# Altium project Control_Board_Model_C.PrjPcb (part 1 of 3)
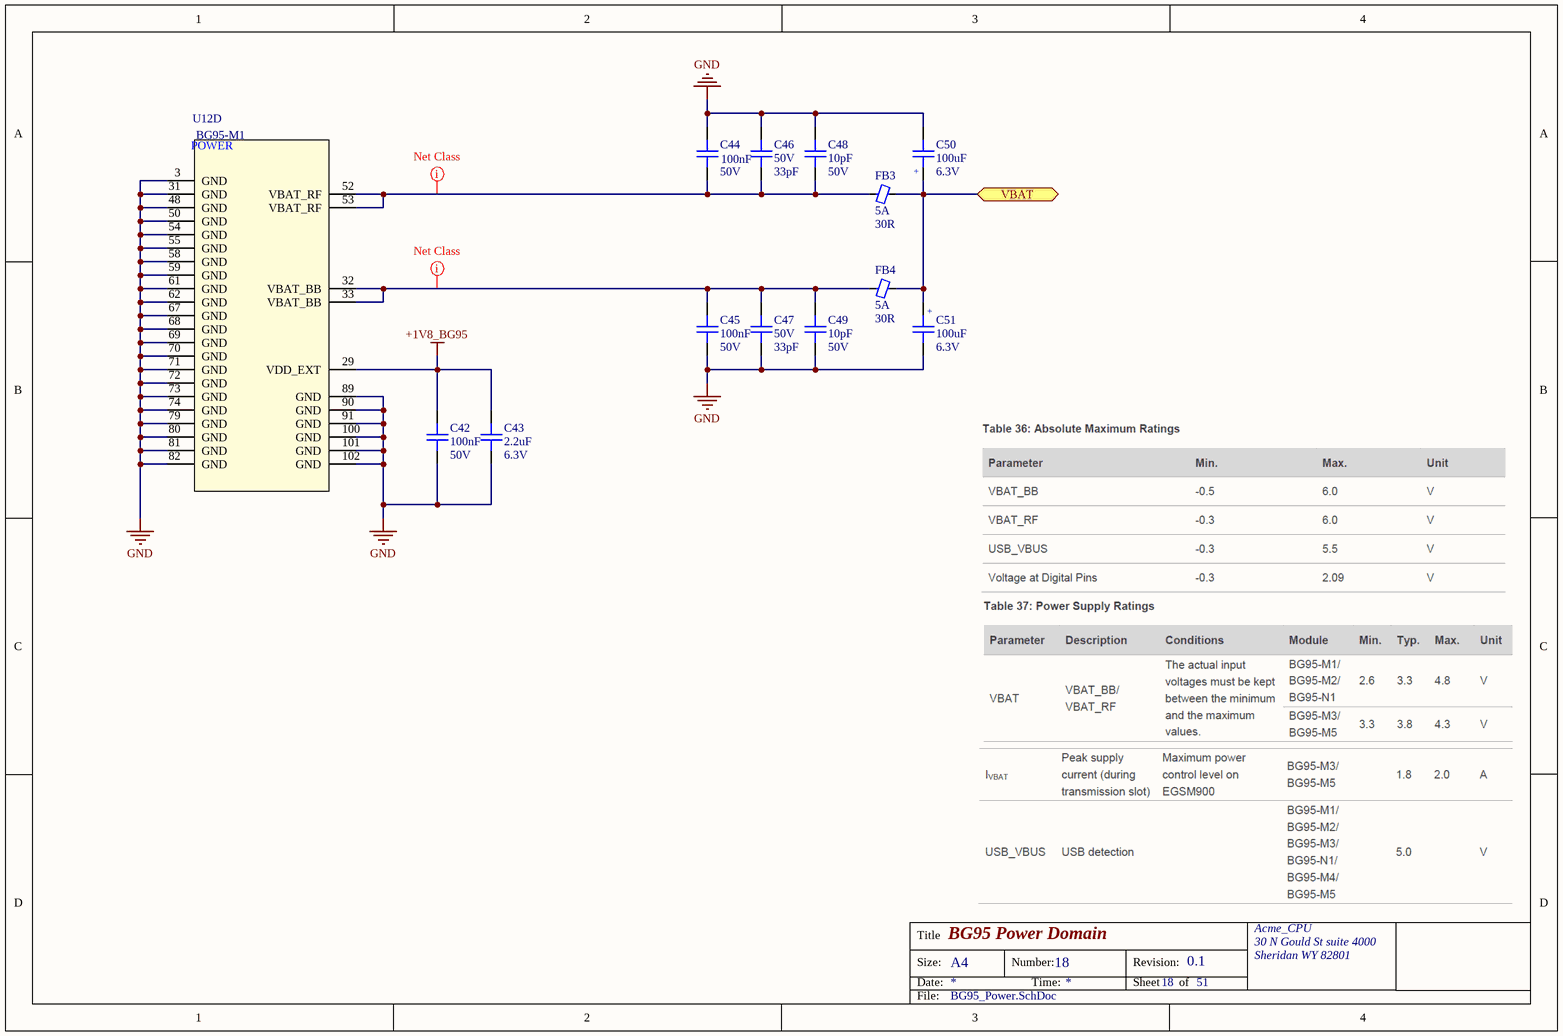
[diagram p0: BG95_Power.SchDoc]
_Title: Control_Board; _Revision: 0.1; _PCBNumber: 001; _PCBModel: C202; _HWEngineer: VSI; _DocumentDate: 20210305; _DateCode: 2021.12; _CompanyName: Acme_CPU; _BoardName: Control_Board; _ApprovedBy: PGU; _address2: Sheridan WY 82801; _address1: 30 N Gould St suite 4000
12 sheets, 113 parts. Net scope: hierarchical (ports join the sheet entries above them; power ports are global).
Board files: Control_Board_Model_C_Rigid_Flex.PcbDoc, Control_Board_Model_C_Rigid_Flex_Flipped.PcbDoc
Sheets:
  BG95_Power.SchDoc
  BG95_Misc.SchDoc
  Top_Level_Block_Diagram.SchDoc
    P104 = MCU_Module.SchDoc
      P02 = UART_TagConnect.SchDoc
    P16_P25 = Motor Connection.SchDoc
    SENS = Sensor Connection.SchDoc
      TLT_SENS = BMI270_IMU.SchDoc
    UI = User_Interface.SchDoc
    AUX = Auxiliary.SchDoc
    P107 = ESP32_Module.SchDoc
  IM69D130_MEMS_Microphone.SchDoc

## Sheet BG95_Power.SchDoc: BG95 Power Domain
size A4; DocumentNumber: 18; SheetNumber: 18; SheetTotal: 51

### Parts
C42  Capacitance: 100nF  Voltage: 50V  [C0402]  (hidden comment: CAP CER 0.1UF 50V X7R 0402)
C43  Capacitance: 2.2uF  Voltage: 6.3V  [C0402]  (hidden comment: CAP CER 2.2UF 6.3V X5R 0402)
C44  Capacitance: 100nF  Voltage: 50V  [C0402]  (hidden comment: CAP CER 0.1UF 50V X7R 0402)
C45  Capacitance: 100nF  Voltage: 50V  [C0402]  (hidden comment: CAP CER 0.1UF 50V X7R 0402)
C46  Voltage Rating: 50V  Capacitance: 33pF  [C0402]  (hidden comment: CAP CER 33PF 50V C0G/NPO 0402)
C47  Voltage Rating: 50V  Capacitance: 33pF  [C0402]  (hidden comment: CAP CER 33PF 50V C0G/NPO 0402)
C48  Capacitance: 10pF  Voltage Rating: 50V  [C0402]  (hidden comment: CAP CER 10PF 50V C0G/NP0 0402)
C49  Capacitance: 10pF  Voltage Rating: 50V  [C0402]  (hidden comment: CAP CER 10PF 50V C0G/NP0 0402)
C50  Capacitance: 100uF  Voltage Rating: 6.3V  [WCAP-ASLI_5x5.5]  (hidden comment: CAP ALUM 100 UF 20% 6.3 V SMD)
C51  Capacitance: 100uF  Voltage Rating: 6.3V  [WCAP-ASLI_5x5.5]  (hidden comment: CAP ALUM 100 UF 20% 6.3 V SMD)
FB3  Current Rating: 5A  Impedance: 30R  [L0603]  (hidden comment: MPZ1608S300ATAH0)
FB4  Current Rating: 5A  Impedance: 30R  [L0603]  (hidden comment: MPZ1608S300ATAH0)
U12  BG95-M1  [BG95]  (part D of 6)

### Ports
VBAT

### Nets
+1V8_BG95: C42.2 C43.2 U12.29(VDD_EXT)
GND: C42.1 C43.1 C44.2 C45.1 C46.2 C47.1 C48.2 C49.1 C50.2 C51.2 U12.3(GND) U12.31(GND) U12.48(GND) U12.50(GND) U12.54(GND) U12.55(GND) U12.58(GND) U12.59(GND) U12.61(GND) U12.62(GND) U12.67(GND) U12.68(GND) U12.69(GND) U12.70(GND) U12.71(GND) U12.72(GND) U12.73(GND) U12.74(GND) U12.79(GND) U12.80(GND) U12.81(GND) U12.82(GND) U12.89(GND) U12.90(GND) U12.91(GND) U12.100(GND) U12.101(GND) U12.102(GND)
NetC44_1: C44.1 C46.1 C48.1 FB3.1 U12.52(VBAT_RF) U12.53(VBAT_RF)
NetC45_2: C45.2 C47.2 C49.2 FB4.1 U12.32(VBAT_BB) U12.33(VBAT_BB)
NetC50_1: C50.1 C51.1 FB3.2 FB4.2 ; port VBAT

### Layout directives
net class BG95_PWR: NetC44_1, NetC45_2

### Notes on the sheet
- Title
- Size:
- Date:
- A4
- Number:
- Time:
- Revision:
- Sheet
- of
- File:
- (in symbol CAP ALUM 100 UF 20% 6.3 V SMD) +
- (in symbol MOD BG95 RX TXRX CELLULAR LTE/NAV SMD, part D) POWER

### Library data of the parts
C42 C44 C45 = CAP CER 0.1UF 50V X7R 0402: 0.1µF ±10% 50V Ceramic Capacitor X7R 0402 (1005 Metric); Manufacturer: TDK; Manufacturer Part Number: CGA2B3X7R1H104K050BB; Supplier 1: Digi-Key; Stock 1: 2925303; Pricing 1: 1=0.17, 10=0.118, 50=0.0668, 100=0.0553, 500=0.0388, 1000=0.0321, 2500=0.0299, 5000=0.0273 (USD); Mount: Surface Mount; Case/Package: 0402; Weight: 2.3E-05oz; Case Code (Metric): 1005; Case Code (Imperial): 0402; Min Operating Temperature: -55°C; Max Operating Temperature: 125°C; Voltage Rating: 50V; Tolerance: 10%; Packaging: Tape and Reel; Package Quantity: 1; Voltage Rating (DC): 50V; Dielectric: X7R; Termination: SMD/SMT; Composition: Ceramic; Length: 1mm; Height: 0.5mm; Width: 0.02inch; Thickness: 0.022inch; Depth: 0.5mm; Ratings: AEC-Q200; REACH SVHC: No SVHC; Lead Free: Lead Free; ComponentLink1URL: http://product.tdk.com/capacitor/mlcc/en/documents/mlccspec_automotive_general_midvoltage_en.pdf?src-supplier=Future+Electronics; ComponentLink1Description: http://product.tdk.com/capacitor/mlcc/en/documents/mlccspec_automotive_general_midvoltage_en.pdf?src-supplier=Future+Electronics; ComponentLink2URL: http://www.farnell.com/datasheets/1807242.pdf?src-supplier=Element14; ComponentLink2Description: http://www.farnell.com/datasheets/1807242.pdf?src-supplier=Element14; ComponentLink3URL: http://www.mouser.com/ds/2/400/lcc_automotive_general_en-843974.pdf?src-supplier=Mouser; ComponentLink3Description: http://www.mouser.com/ds/2/400/lcc_automotive_general_en-843974.pdf?src-supplier=Mouser; ComponentLink4URL: http://www.farnell.com/datasheets/1936565.pdf?src-supplier=Element14; ComponentLink4Description: http://www.farnell.com/datasheets/1936565.pdf?src-supplier=Element14; ComponentLink5URL: http://www.farnell.com/datasheets/1735392.pdf?src-supplier=Element14; ComponentLink5Description: http://www.farnell.com/datasheets/1735392.pdf?src-supplier=Element14; Supplier Part Number 1: 445-6899-1-ND; ClassName: P109
C43 = CAP CER 2.2UF 6.3V X5R 0402: 2.2µF ±20% 6.3V Ceramic Capacitor X5R 0402 (1005 Metric); Manufacturer: Murata; Manufacturer Part Number: GRM155R60J225ME15D; Supplier 1: Digi-Key; Stock 1: 4444410; Pricing 1: 1=0.29, 10=0.199, 100=0.1009, 500=0.0691, 1000=0.0611, 2500=0.0584, 5000=0.0531 (USD); Mount: Surface Mount; Case/Package: 0402; Case Code (Metric): 1005; Case Code (Imperial): 0402; Min Operating Temperature: -55°C; Max Operating Temperature: 85°C; Voltage Rating: 6.3V; Tolerance: 20%; Packaging: Tape and Reel; Package Quantity: 10000; Voltage Rating (DC): 6.3V; Dielectric: X5R; Termination: SMD/SMT; Length: 1mm; Height: 0.5mm; Width: 0.02inch; Thickness: 0.022inch; Depth: 0.5mm; REACH SVHC: No SVHC; Lead Free: Lead Free; ComponentLink1URL: https://www.murata.com/~/media/webrenewal/support/library/catalog/products/capacitor/mlcc/c02e.ashx?la=en-us&src-supplier=Digi-Key; ComponentLink1Description: https://www.murata.com/~/media/webrenewal/support/library/catalog/products/capacitor/mlcc/c02e.ashx?la=en-us&src-supplier=Digi-Key; ComponentLink2URL: http://www.murata.com/~/media/webrenewal/support/library/catalog/products/capacitor/mlcc/c02e.ashx?src-supplier=Avnet; ComponentLink2Description: http://www.murata.com/~/media/webrenewal/support/library/catalog/products/capacitor/mlcc/c02e.ashx?src-supplier=Avnet; ComponentLink3URL: http://www.farnell.com/datasheets/2047859.pdf?src-supplier=Element14; ComponentLink3Description: http://www.farnell.com/datasheets/2047859.pdf?src-supplier=Element14; ComponentLink4URL: https://produktinfo.conrad.com/datenblaetter/450000-474999/450128-da-01-de-VS_KONDENS_GRM155_R60J_225ME15D.pdf?src-supplier=Conrad; ComponentLink4Description: https://produktinfo.conrad.com/datenblaetter/450000-474999/450128-da-01-de-VS_KONDENS_GRM155_R60J_225ME15D.pdf?src-supplier=Conrad; Supplier Part Number 1: 490-4519-1-ND; Material: Ceramic; Radiation Hardening: No; ClassName: P109
C46 C47 = CAP CER 33PF 50V C0G/NPO 0402: 33pF ±5% 50V Ceramic Capacitor C0G, NP0 0402 (1005 Metric); Manufacturer: Yageo; Manufacturer Part Number: CC0402JRNPO9BN330; Insulation Resistance: 100GR; Supplier 1: Digi-Key; Stock 1: 622219; Pricing 1: 1=0.1, 10=0.022, 100=0.0099, 500=0.0071, 1000=0.0056, 2500=0.0051, 5000=0.0047 (USD); Mount: Surface Mount; Number of Pins: 2; Weight: 2.3E-05oz; Case Code (Imperial): 0402; Case Code (Metric): 1005; Dielectric Material: Ceramic; Min Operating Temperature: -55°C; Max Operating Temperature: 125°C; Tolerance: 5%; Dielectric: C0G; Voltage Rating (DC): 50V; Packaging: Tape and Reel; Package Quantity: 1; Termination: SMD/SMT; Composition: Ceramic; Length: 1mm; Height: 0.5mm; Depth: 0.5mm; Width: 0.5mm; Thickness: 0.022inch; Radiation Hardening: No; REACH SVHC: No SVHC; Lead Free: Lead Free; ComponentLink1URL: https://www.verical.com/server-webapp/html/getDatasheet?partID=403453&src-supplier=Verical; ComponentLink1Description: https://www.verical.com/server-webapp/html/getDatasheet?partID=403453&src-supplier=Verical; ComponentLink2URL: http://www.farnell.com/datasheets/2213336.pdf?src-supplier=Element14; ComponentLink2Description: http://www.farnell.com/datasheets/2213336.pdf?src-supplier=Element14; ComponentLink3URL: http://www.mouser.com/ds/2/447/Yageo_UPY-GP_NP0_16V-to-50V_9-358835.pdf?src-supplier=Mouser; ComponentLink3Description: http://www.mouser.com/ds/2/447/Yageo_UPY-GP_NP0_16V-to-50V_9-358835.pdf?src-supplier=Mouser; ComponentLink4URL: http://www.yageo.com/documents/recent/UPY-GP_NP0_16V-to-50V_16.pdf?src-supplier=Digi-Key; ComponentLink4Description: http://www.yageo.com/documents/recent/UPY-GP_NP0_16V-to-50V_16.pdf?src-supplier=Digi-Key; ComponentLink5URL: http://www.yageo.com/documents/recent/UPY-GP_NP0_16V-to-50V_8.pdf?src-supplier=Avnet+Europe; ComponentLink5Description: http://www.yageo.com/documents/recent/UPY-GP_NP0_16V-to-50V_8.pdf?src-supplier=Avnet+Europe; Supplier Part Number 1: 311-1020-1-ND; Case/Package: 0402; ClassName: P109
C48 C49 = CAP CER 10PF 50V C0G/NP0 0402: 10pF ±10% 50V Ceramic Capacitor C0G, NP0 0402 (1005 Metric); Manufacturer: KEMET; Manufacturer Part Number: C0402C100K5GACTU; Dissipation Factor: 0.1%; Supplier 1: Digi-Key; Stock 1: 57093; Pricing 1: 1=0.1, 10=0.021, 50=0.0116, 100=0.0095, 500=0.0068, 1000=0.0053, 2500=0.0048, 5000=0.0045 (USD); Mount: Surface Mount; Case/Package: 0402; Case Code (Metric): 1005; Case Code (Imperial): 0402; Dielectric Material: Ceramic; Min Operating Temperature: -55°C; Max Operating Temperature: 125°C; Tolerance: 10%; Packaging: Tape and Reel; Package Quantity: 10000; Voltage Rating (DC): 50V; Dielectric: C0G; Termination: SMD/SMT; Length: 1mm; Height: 0.5mm; Width: 0.02inch; Thickness: 0.022inch; Lead Pitch: 0.3mm; Depth: 0.5mm; Radiation Hardening: No; REACH SVHC: No SVHC; Lead Free: Lead Free; ComponentLink1URL: http://www.mouser.com/ds/2/212/KEM_C1003_C0G_SMD-1101588.pdf?src-supplier=Mouser; ComponentLink1Description: http://www.mouser.com/ds/2/212/KEM_C1003_C0G_SMD-1101588.pdf?src-supplier=Mouser; Supplier Part Number 1: 399-7747-1-ND; ClassName: P109
C50 C51 = CAP ALUM 100 UF 20% 6.3 V SMD: 100µF 6.3V Aluminum Electrolytic Capacitors Radial, Can - SMD  2000 Hrs @ 105°C; Manufacturer: Wurth Elektronik; Manufacturer Part Number: 865080142007; Ripple Current: 170mA; Life (Hours): 2000Hour; Leakage Current: 6.3uA; Dissipation Factor: 24%; Endurance: 2000h; Capacitance Tolerance: +/-20%; Technical Reference: ASEC055101M6R3DVCTBB000; Polarity: Polar; Impedance: 800mR; Supplier 1: Digi-Key; Stock 1: 2227; Pricing 1: 1=0.2, 50=0.167, 100=0.145, 250=0.129, 500=0.113 (USD); Mount: Surface Mount; Case/Package: Radial; Min Operating Temperature: -55°C; Max Operating Temperature: 105°C; Package Quantity: 1000; Packaging: Tape and Reel; Tolerance: 20%; Height - Seated (Max): 0.217inch; ComponentLink1URL: http://www.we-online.de; ComponentLink1Description: Manufacturer; Supplier Part Number 1: 732-8472-1-ND; Ripple Current (AC): 170mA; Voltage Rating (DC): 6.3V; Diameter: 5mm; Height: 5.5mm; REACH SVHC: Unknown; ComponentLink2URL: https://www.we-online.com/catalog/datasheet/865080142007.pdf; ComponentLink2Description: Datasheet; Mounting Technology: SMT; Operating Temperature: -55 to +105degC; Published Date: May 2020; ComponentLink3URL: http://www.farnell.com/datasheets/1880090.pdf?src-supplier=Farnell; ComponentLink3Description: http://www.farnell.com/datasheets/1880090.pdf?src-supplier=Farnell; ComponentLink4URL: http://www.farnell.com/datasheets/1880090.pdf?src-supplier=Newark; ComponentLink4Description: http://www.farnell.com/datasheets/1880090.pdf?src-supplier=Newark; ComponentLink5URL: http://katalog.we-online.de/pbs/datasheet/865080142007.pdf?src-supplier=Digi-Key; ComponentLink5Description: http://katalog.we-online.de/pbs/datasheet/865080142007.pdf?src-supplier=Digi-Key; ComponentLink6URL: http://www.farnell.com/datasheets/1880090.pdf?src-supplier=Element14; ComponentLink6Description: http://www.farnell.com/datasheets/1880090.pdf?src-supplier=Element14; ComponentLink7URL: https://katalog.we-online.de/pbs/datasheet/865080142007.pdf?src-supplier=Digi-Key; ComponentLink7Description: https://katalog.we-online.de/pbs/datasheet/865080142007.pdf?src-supplier=Digi-Key; ClassName: P109
FB3 FB4 = FERRITE BEAD 30 OHM 0603 1LN: 30 Ohms @ 100MHz 1 Power Line Ferrite Bead 0603 (1608 Metric) 5A 10mOhm; Manufacturer: TDK; Tolerance: 25%; DC Resistance (DCR): 10mR; Supplier 1: Digi-Key; Manufacturer Part Number: MPZ1608S300ATAH0; Stock 1: 93167; Pricing 1: 1=0.1, 10=0.079, 25=0.0716, 50=0.0644, 100=0.0472, 250=0.0343, 500=0.0315, 1000=0.0272 (USD); Case/Package: 0603; Case Code (Metric): 1608; Case Code (Imperial): 0603; Min Operating Temperature: -55°C; Max Operating Temperature: 125°C; Package Quantity: 4000; Packaging: Tape and Reel; Termination: SMD/SMT; Length: 0.063inch; Height: 0.6mm; Width: 0.031inch; Depth: 0.8mm; REACH SVHC: No SVHC; Lead Free: Lead Free; ComponentLink1URL: https://media.digikey.com/pdf/Data%20Sheets/TDK%20PDFs/MPZ_Series_Br.pdf?src-supplier=Digi-Key; ComponentLink1Description: https://media.digikey.com/pdf/Data%20Sheets/TDK%20PDFs/MPZ_Series_Br.pdf?src-supplier=Digi-Key; ComponentLink2URL: http://www.farnell.com/datasheets/1795297.pdf?src-supplier=Element14; ComponentLink2Description: http://www.farnell.com/datasheets/1795297.pdf?src-supplier=Element14; Supplier Part Number 1: 445-1562-6-ND; Max DC Current: 5A; Test Frequency: 100MHz; Revision: July-2002: Re-released for DXP Platform.; Mount: Surface Mount; Weight: 7.1E-05oz; Core Material: Ferrite; ClassName: P109
U12 = MOD BG95 RX TXRX CELLULAR LTE/NAV SMD: LTE Cat M1, LTE Cat NB2 and EGPRS Transceiver Module Antenna Not Included Surface Mount; Manufacturer: QUECTEL; Part Description: IC MODULE BG95 102-LGA 19.9x23.6mm H2.2mm RO; Geometry.Height: 2.2mm; Value: BG95; Manufacturer Part Number: BG95-M1; PCB DECAL: BG95; Mount: Surface Mount

## Sheet BG95_Misc.SchDoc: BG95_Misc
size A4; DocumentNumber: 19; SheetNumber: 19; SheetTotal: 51
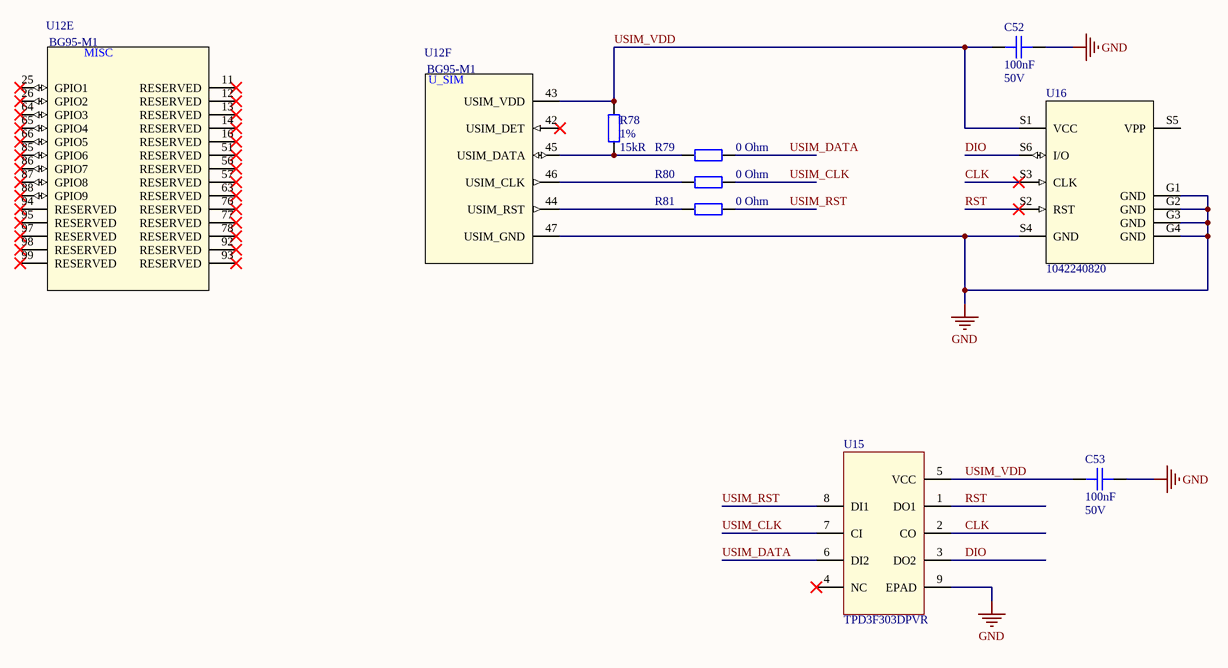
[diagram p1: BG95_Misc.SchDoc]

### Parts
C52  Capacitance: 100nF  Voltage: 50V  [C0402]  (hidden comment: CAP CER 0.1UF 50V X7R 0402)
C53  Capacitance: 100nF  Voltage: 50V  [C0402]  (hidden comment: CAP CER 0.1UF 50V X7R 0402)
R78  Tolerance: 1%  Resistance: 15kR  [R0402]  (hidden comment: RES SMD 15K OHM 1% 1/16W 0402)
R79  Resistance: 0 Ohm  [R0402]  (hidden comment: RES SMD 0 OHM JUMPER 1/16W 0402)
R80  Resistance: 0 Ohm  [R0402]  (hidden comment: RES SMD 0 OHM JUMPER 1/16W 0402)
R81  Resistance: 0 Ohm  [R0402]  (hidden comment: RES SMD 0 OHM JUMPER 1/16W 0402)
U12  BG95-M1  [BG95]  (parts E,F of 6)
U15  TPD3F303DPVR  [DPV8_1P7X0P4]
U16  1042240820  [1042240820_MOL]

### Nets
GND: C52.2 C53.2 U12.47(USIM_GND) U15.9(EPAD) U16.G1(GND) U16.G2(GND) U16.G3(GND) U16.G4(GND) U16.S4(GND)
CLK: U15.2(CO) U16.S3(CLK)
DIO: U15.3(DO2) U16.S6(I/O)
RST: U15.1(DO1) U16.S2(RST)
USIM_CLK: R80.2 U15.7(CI)
USIM_DATA: R79.2 U15.6(DI2)
USIM_RST: R81.2 U15.8(DI1)
USIM_VDD: C52.1 C53.1 R78.2 U12.43(USIM_VDD) U15.5(VCC) U16.S1(VCC)
NetR78_1: R78.1 R79.1 U12.45(USIM_DATA)
NetR80_1: R80.1 U12.46(USIM_CLK)
NetR81_1: R81.1 U12.44(USIM_RST)

Not connected (* = marked no-connect by the designer): U12 11(RESERVED)* 12(RESERVED)* 13(RESERVED)* 14(RESERVED)* 16(RESERVED)* 25(GPIO1)* 26(GPIO2)* 42(USIM_DET)* 51(RESERVED)* 56(RESERVED)* 57(RESERVED)* 63(RESERVED)* 64(GPIO3)* 65(GPIO4)* 66(GPIO5)* 76(RESERVED)* 77(RESERVED)* 78(RESERVED)* 85(GPIO6)* 86(GPIO7)* 87(GPIO8)* 88(GPIO9)* 92(RESERVED)* 93(RESERVED)* 94(RESERVED)* 95(RESERVED)* 97(RESERVED)* 98(RESERVED)* 99(RESERVED)*; U15 4(NC)*; U16 S5(VPP)

### Notes on the sheet
- Title
- Size:
- Date:
- A4
- Number:
- Time:
- Revision:
- Sheet
- of
- File:
- (in symbol MOD BG95 RX TXRX CELLULAR LTE/NAV SMD, part E) MISC
- (in symbol MOD BG95 RX TXRX CELLULAR LTE/NAV SMD, part F) U_SIM

### Library data of the parts
C52 C53 = CAP CER 0.1UF 50V X7R 0402: as C42 on sheet BG95_Power; Supplier 1: Digi-Key; Stock 1: 2925303; Pricing 1: 1=0.17, 10=0.118, 50=0.0668, 100=0.0553, 500=0.0388, 1000=0.0321, 2500=0.0299, 5000=0.0273 (USD); Mount: Surface Mount; Case/Package: 0402; Weight: 2.3E-05oz; Case Code (Metric): 1005; Case Code (Imperial): 0402; Min Operating Temperature: -55°C; Max Operating Temperature: 125°C; Voltage Rating: 50V; Tolerance: 10%; Packaging: Tape and Reel; Package Quantity: 1; Voltage Rating (DC): 50V; Dielectric: X7R; Termination: SMD/SMT; Composition: Ceramic; Length: 1mm; Height: 0.5mm; Width: 0.02inch; Thickness: 0.022inch; Depth: 0.5mm; Ratings: AEC-Q200; REACH SVHC: No SVHC; Lead Free: Lead Free; ComponentLink1URL: http://product.tdk.com/capacitor/mlcc/en/documents/mlccspec_automotive_general_midvoltage_en.pdf?src-supplier=Future+Electronics; ComponentLink1Description: http://product.tdk.com/capacitor/mlcc/en/documents/mlccspec_automotive_general_midvoltage_en.pdf?src-supplier=Future+Electronics; ComponentLink2URL: http://www.farnell.com/datasheets/1807242.pdf?src-supplier=Element14; ComponentLink2Description: http://www.farnell.com/datasheets/1807242.pdf?src-supplier=Element14; ComponentLink3URL: http://www.mouser.com/ds/2/400/lcc_automotive_general_en-843974.pdf?src-supplier=Mouser; ComponentLink3Description: http://www.mouser.com/ds/2/400/lcc_automotive_general_en-843974.pdf?src-supplier=Mouser; ComponentLink4URL: http://www.farnell.com/datasheets/1936565.pdf?src-supplier=Element14; ComponentLink4Description: http://www.farnell.com/datasheets/1936565.pdf?src-supplier=Element14; ComponentLink5URL: http://www.farnell.com/datasheets/1735392.pdf?src-supplier=Element14; ComponentLink5Description: http://www.farnell.com/datasheets/1735392.pdf?src-supplier=Element14; Supplier Part Number 1: 445-6899-1-ND
R78 = RES SMD 15K OHM 1% 1/16W 0402: 15 kOhms ±1% 0.063W, 1/16W Chip Resistor 0402 (1005 Metric)  Thick Film; Manufacturer: Yageo; Manufacturer Part Number: RC0402FR-0715KL; Power Rating: 62.5mW; Voltage Rating: 50V; Temperature Coefficient: 100ppm/°C; Max Power Dissipation: 63mW; Supplier 1: Digi-Key; Stock 1: 5005874; Pricing 1: 1=0.1, 10=0.014, 100=0.0058, 1000=0.0026, 2500=0.0023, 5000=0.0019 (USD); Case/Package: 0402; Number of Pins: 2; Weight: 2.3E-05oz; Case Code (Imperial): 0402; Case Code (Metric): 1005; Min Operating Temperature: -55°C; Max Operating Temperature: 155°C; Packaging: Tape and Reel; Package Quantity: 1; Termination: SMD/SMT; Resistor Type: Thick Film; Number of Terminations: 2; Features: Moisture Resistant; Voltage Rating (DC): 50V; Length: 1mm; Height: 0.016inch; Width: 0.5mm; Depth: 0.5mm; REACH SVHC: No SVHC; Military Standard: Not; Lead Free: Lead Free; ComponentLink1URL: http://www.farnell.com/datasheets/2167052.pdf?src-supplier=Element14; ComponentLink1Description: http://www.farnell.com/datasheets/2167052.pdf?src-supplier=Element14; ComponentLink2URL: http://www.mouser.com/ds/2/447/PYu-RC0402_51_RoHS_L_6_r-8721.pdf?src-supplier=Mouser; ComponentLink2Description: http://www.mouser.com/ds/2/447/PYu-RC0402_51_RoHS_L_6_r-8721.pdf?src-supplier=Mouser; ComponentLink3URL: http://www.yageo.com/documents/recent/PYu-RC_Group_51_RoHS_L_10.pdf?src-supplier=Digi-Key; ComponentLink3Description: http://www.yageo.com/documents/recent/PYu-RC_Group_51_RoHS_L_10.pdf?src-supplier=Digi-Key; ComponentLink4URL: http://www.yageo.com/documents/recent/PYu-RC0402_51_RoHS_L_6_r.pdf?src-supplier=Future+Electronics; ComponentLink4Description: http://www.yageo.com/documents/recent/PYu-RC0402_51_RoHS_L_6_r.pdf?src-supplier=Future+Electronics; Supplier Part Number 1: 311-15.0KLRCT-ND; Mount: Surface Mount
R79-R81 = RES SMD 0 OHM JUMPER 1/16W 0402: 0 Ohms Jumper 0.063W, 1/16W Chip Resistor 0402 (1005 Metric) Moisture Resistant Thick Film; Manufacturer: Yageo; Manufacturer Part Number: RC0402JR-070RL; Power Rating: 62.5mW; Voltage Rating: 50V; Max Power Dissipation: 63mW; Temperature Coefficient: 200ppm/°C; Tolerance: 5%; Supplier 1: Digi-Key; Stock 1: 46057148; Pricing 1: 1=0.1, 10=0.013, 25=0.0092, 50=0.0072, 100=0.0053, 250=0.004, 500=0.0032, 1000=0.0024, 5000=0.0017 (USD); Contact Plating: Tin,Matte; Case Code (Metric): 1005; Case Code (Imperial): 0402; Min Operating Temperature: -55°C; Max Operating Temperature: 155°C; Packaging: Tape and Reel; Composition: Thick Film; Package Quantity: 1; Number of Terminations: 2; Termination: SMD/SMT; Military Standard: Not; Features: Moisture Resistant; Length: 1mm; Height: 0.016inch; Width: 0.02inch; Depth: 0.5mm; Radiation Hardening: No; REACH SVHC: Unknown; Lead Free: Lead Free; ComponentLink1URL: http://www.yageo.com/documents/recent/PYu-RC_Group_51_RoHS_L_10.pdf?src-supplier=Digi-Key; ComponentLink1Description: http://www.yageo.com/documents/recent/PYu-RC_Group_51_RoHS_L_10.pdf?src-supplier=Digi-Key; ComponentLink2URL: http://www.yageo.com/documents/recent/PYu-RC0402_51_RoHS_L_6.pdf?src-supplier=Avnet+Europe; ComponentLink2Description: http://www.yageo.com/documents/recent/PYu-RC0402_51_RoHS_L_6.pdf?src-supplier=Avnet+Europe; ComponentLink3URL: http://www.farnell.com/datasheets/1018594.pdf?src-supplier=Element14; ComponentLink3Description: http://www.farnell.com/datasheets/1018594.pdf?src-supplier=Element14; ComponentLink4URL: https://www.verical.com/server-webapp/html/getDatasheet?partID=326379&src-supplier=Verical; ComponentLink4Description: https://www.verical.com/server-webapp/html/getDatasheet?partID=326379&src-supplier=Verical; ComponentLink5URL: http://www.farnell.com/datasheets/2167052.pdf?src-supplier=Element14; ComponentLink5Description: http://www.farnell.com/datasheets/2167052.pdf?src-supplier=Element14; Supplier Part Number 1: 311-0.0JRCT-ND; Case/Package: 0402; Mount: Surface Mount
U12 = MOD BG95 RX TXRX CELLULAR LTE/NAV SMD: as U12 on sheet BG95_Power; Manufacturer Part Number: BG95-M1; PCB DECAL: BG95; Mount: Surface Mount
U15 = FILTER RC(PI) ESD SMD  8-UFDFN EP: RC (Pi) EMI Filter 2nd Order Low Pass 3 Channel R = 47Ohms, 100Ohms, C = 20pF  8-UFDFN Exposed Pad; Manufacturer: Texas Instruments; Number of Channels: 3; Operating Supply Voltage: 5.5V; Clamping Voltage: 10V; ESD Protection: Yes; Frequency: 308MHz; Supplier 1: Digi-Key; Manufacturer Part Number: TPD3F303DPVR; Stock 1: 4896; Pricing 1: 1=0.85, 10=0.812, 25=0.7856, 50=0.6414, 100=0.576, 250=0.5236, 500=0.4974, 1000=0.4451 (USD); Number of Pins: 8; Min Operating Temperature: -40°C; Max Operating Temperature: 85°C; Package Quantity: 1; Packaging: Tape and Reel; Termination: Flat; REACH SVHC: No SVHC; Lead Free: Lead Free; ComponentLink1URL: http://www.ti.com/lit/ds/symlink/tpd3f303.pdf?src-supplier=Digi-Key; ComponentLink1Description: http://www.ti.com/lit/ds/symlink/tpd3f303.pdf?src-supplier=Digi-Key; ComponentLink2URL: http://focus.ti.com/lit/ds/symlink/tpd3f303.pdf?src-supplier=Avnet+Europe; ComponentLink2Description: http://focus.ti.com/lit/ds/symlink/tpd3f303.pdf?src-supplier=Avnet+Europe; ComponentLink3URL: https://www.verical.com/server-webapp/html/getDatasheet?partID=302817&src-supplier=Verical; ComponentLink3Description: https://www.verical.com/server-webapp/html/getDatasheet?partID=302817&src-supplier=Verical; ComponentLink4URL: http://www.farnell.com/datasheets/1558442.pdf?src-supplier=Element14; ComponentLink4Description: http://www.farnell.com/datasheets/1558442.pdf?src-supplier=Element14; Supplier Part Number 1: 296-28299-1-ND; Case/Package: SMD/SMT; Contact Plating: Gold; Capacitance: 20pF; Length: 2.2mm; Height: 0.026inch; Width: 0.063inch; Depth: 1.7mm; Radiation Hardening: No; Mount: Surface Mount
U16 = NANOSIM SOCKET 1.11H P/PULL TYPE: 6 Position Card Connector NANO SIM Surface Mount, Right Angle Gold; Manufacturer: Molex; Number of Positions: 6; Pitch: 2.54mm; Supplier 1: Digi-Key; Manufacturer Part Number: 1042240820; Stock 1: 10989; Pricing 1: 1=1.31, 10=1.152, 25=1.0844, 50=1.039, 100=0.9939, 250=0.9036, 500=0.8132, 1000=0.7228 (USD); Mount: Surface Mount; Contact Plating: Gold; Number of Rows: 2; Orientation: Right Angle; Connector Type: Connector; Packaging: Tape and Reel; ComponentLink1URL: https://www.molex.com/pdm_docs/sd/1042240820_sd.pdf?src-supplier=Digi-Key; ComponentLink1Description: https://www.molex.com/pdm_docs/sd/1042240820_sd.pdf?src-supplier=Digi-Key; ComponentLink2URL: http://www.molex.com/pdm_docs/sd/1042240820_sd.pdf?src-supplier=Avnet; ComponentLink2Description: http://www.molex.com/pdm_docs/sd/1042240820_sd.pdf?src-supplier=Avnet; Supplier Part Number 1: WM23749CT-ND

## Sheet Top_Level_Block_Diagram.SchDoc: BLDC Motor Driver Block Diagram
size A3; DocumentNumber: 1; SheetNumber: 1; SheetTotal: 51
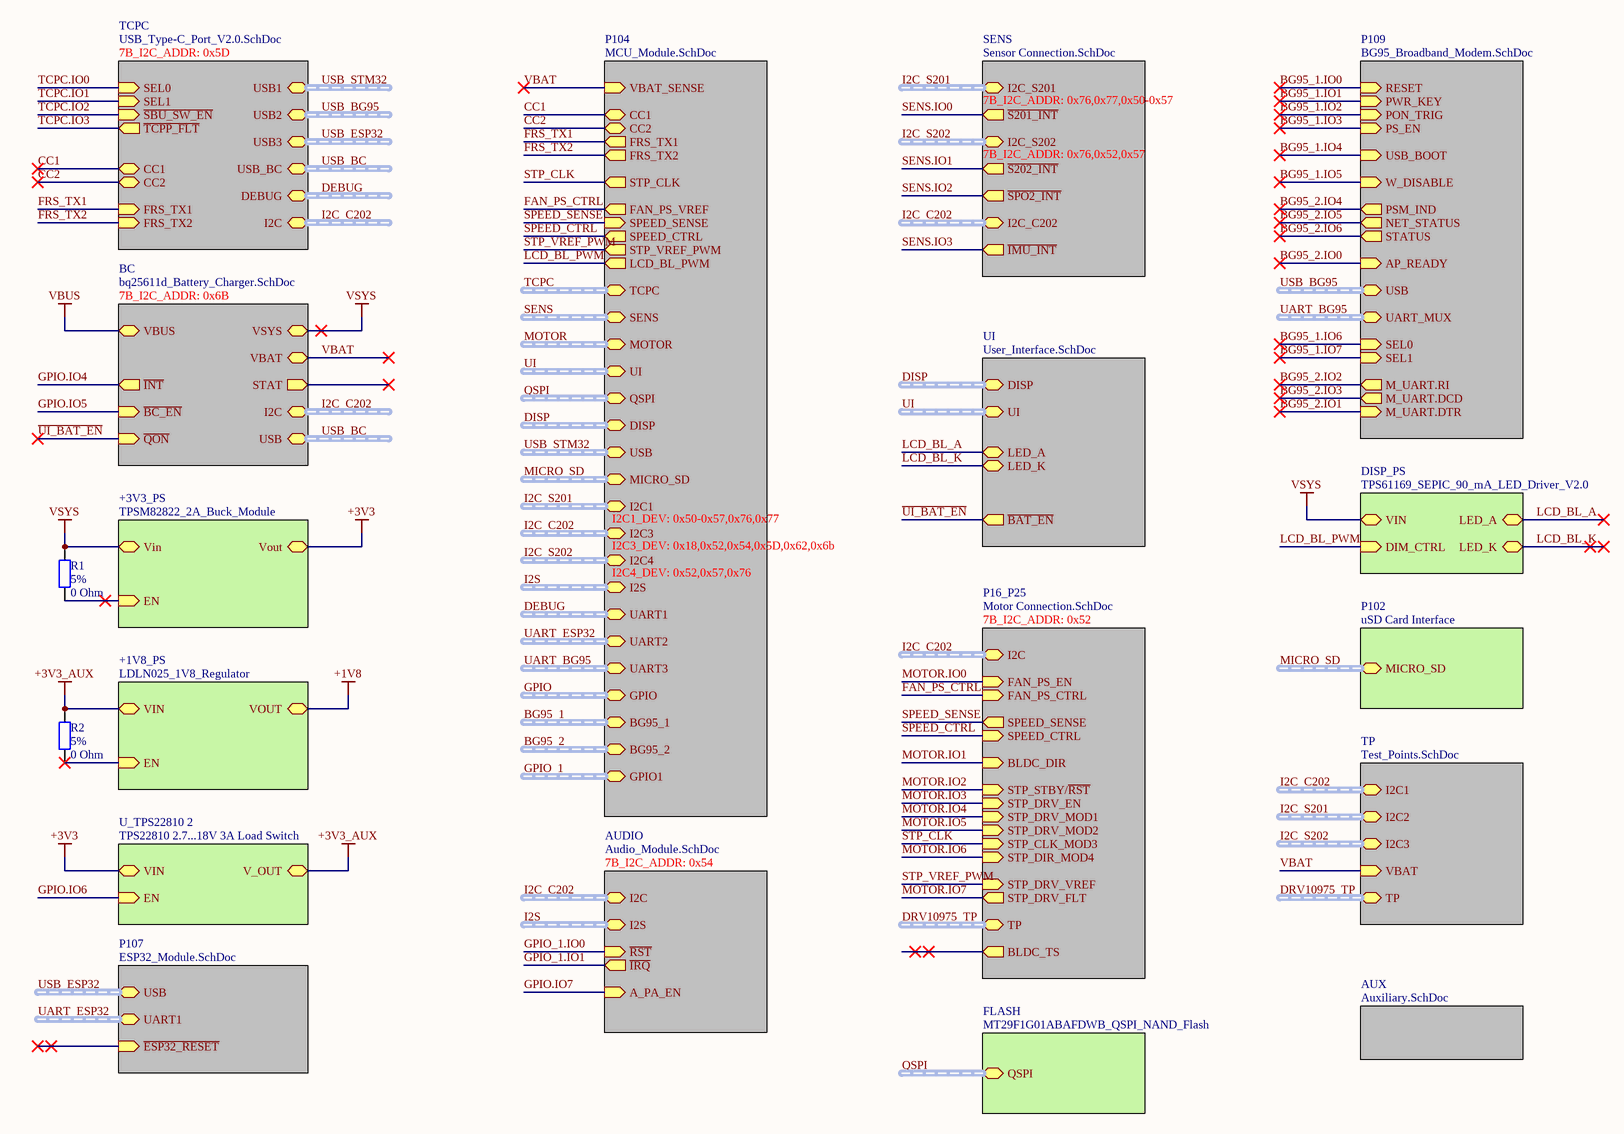
[diagram p2: Top_Level_Block_Diagram.SchDoc]

### Parts
R1  Tolerance: 5%  Resistance: 0 Ohm  [R0402]  (hidden comment: RES SMD 0 OHM JUMPER 1/16W 0402)
R2  Tolerance: 5%  Resistance: 0 Ohm  [R0402]  (hidden comment: RES SMD 0 OHM JUMPER 1/16W 0402)

### Sub-sheets
+1V8_PS = LDLN025_1V8_Regulator (file not in this document): EN (in), VIN, VOUT
+3V3_PS = TPSM82822_2A_Buck_Module (file not in this document): Vout, Vin, EN (in)
AUDIO = Audio_Module.SchDoc (file not in this document): I2S (harness I2S), I2C (harness I2C), ~{RST} (in), ~{IRQ} (out), A_PA_EN (in)  | 7B_I2C_ADDR: 0x54
AUX = Auxiliary.SchDoc: no entries
BC = bq25611d_Battery_Charger.SchDoc (file not in this document): VSYS, VBUS, ~{QON} (in), USB (harness USB), I2C (harness I2C), ~{INT} (out), STAT (out), ~{BC_EN} (in), VBAT  | 7B_I2C_ADDR: 0x6B
DISP_PS = TPS61169_SEPIC_90_mA_LED_Driver_V2.0 (file not in this document): VIN, LED_K, DIM_CTRL (in), LED_A
FLASH = MT29F1G01ABAFDWB_QSPI_NAND_Flash (file not in this document): QSPI (harness QSPI)
P16_P25 = Motor Connection.SchDoc: SPEED_CTRL (in), SPEED_SENSE (out), FAN_PS_CTRL (in), BLDC_DIR (in), I2C (harness I2C), STP_STBY/~{RST} (in), STP_DRV_EN (in), STP_DRV_MOD1 (in), STP_DRV_MOD2 (in), STP_CLK_MOD3 (in), STP_DIR_MOD4 (in), STP_DRV_VREF (in), STP_DRV_FLT (out), FAN_PS_EN (in), TP (harness DRV10975_TP), BLDC_TS (out)  | 7B_I2C_ADDR: 0x52
P102 = uSD Card Interface (file not in this document): MICRO_SD (harness MICRO_SD)
P104 = MCU_Module.SchDoc: FAN_PS_VREF (out), SPEED_CTRL (out), SPEED_SENSE (in), CC2 (bidir), CC1 (bidir), I2C1 (harness I2C), VBAT_SENSE (in), MICRO_SD (harness MICRO_SD), DISP (harness DISP_SPI), USB (harness USB), STP_CLK (out), STP_VREF_PWM (out), LCD_BL_PWM (out), QSPI (harness QSPI), FRS_TX1 (out), FRS_TX2 (out), I2C3 (harness I2C), UART1 (harness DEBUG), I2C4 (harness I2C), UART3 (harness UART), I2S (harness I2S), UART2 (harness UART), GPIO (harness GPIO), MOTOR (harness GPIO), BG95_1 (harness GPIO), SENS (harness GPIO), BG95_2 (harness GPIO), UI (harness GPIO), TCPC (harness GPIO), GPIO1 (harness GPIO)  | I2C3_DEV: 0x18,0x52,0x54,0x5D,0x62,0x6b; I2C1_DEV: 0x50-0x57,0x76,0x77; I2C4_DEV: 0x52,0x57,0x76
P107 = ESP32_Module.SchDoc: ~{ESP32_RESET} (in), UART1 (harness UART), USB (harness USB)
P109 = BG95_Broadband_Modem.SchDoc (file not in this document): PWR_KEY (in), PON_TRIG (in), W_DISABLE (in), USB_BOOT (in), NET_STATUS (out), AP_READY (in), STATUS (out), PSM_IND (out), PS_EN (in), RESET (in), USB (harness USB), SEL1 (in), SEL0 (in), UART_MUX (harness UART), M_UART.RI (out), M_UART.DCD (out), M_UART.DTR (in)
SENS = Sensor Connection.SchDoc: ~{S201_INT} (out), I2C_S201 (harness I2C), I2C_S202 (harness I2C), ~{S202_INT} (out), ~{SPO2_INT} (out), I2C_C202 (harness I2C), ~{IMU_INT} (out)  | 7B_I2C_ADDR: 0x76,0x77,0x50-0x57; 7B_I2C_ADDR: 0x76,0x52,0x57
TCPC = USB_Type-C_Port_V2.0.SchDoc (file not in this document): CC1 (bidir), CC2 (bidir), USB1 (harness USB), USB2 (harness USB), SEL1 (in), SEL0 (in), ~{TCPP_FLT} (out), USB3 (harness USB), USB_BC (harness USB), FRS_TX1 (in), FRS_TX2 (in), I2C (harness I2C), ~{SBU_SW_EN} (in), DEBUG (harness DEBUG)  | 7B_I2C_ADDR: 0x5D
TP = Test_Points.SchDoc (file not in this document): I2C1 (harness I2C), I2C2 (harness I2C), I2C3 (harness I2C), VBAT (in), TP (harness DRV10975_TP)
U_TPS22810 2 = TPS22810 2.7...18V 3A Load Switch (file not in this document): EN (in), V_OUT, VIN
UI = User_Interface.SchDoc: ~{BAT_EN} (out), DISP (harness DISP_SPI), LED_A, LED_K, UI (harness GPIO)

### Nets
+3V3: sheet +3V3_PS/Vout, sheet U_TPS22810 2/VIN
+3V3_AUX: R2.2 ; sheet +1V8_PS/VIN, sheet U_TPS22810 2/V_OUT
VBUS: sheet BC/VBUS
VSYS: R1.2 ; sheet BC/VSYS, sheet +3V3_PS/Vin, sheet DISP_PS/VIN
~{UI_BAT_EN}: sheet BC/~{QON}, sheet UI/~{BAT_EN}
BG95_1.IO0: sheet P109/RESET
BG95_1.IO1: sheet P109/PWR_KEY
BG95_1.IO2: sheet P109/PON_TRIG
BG95_1.IO3: sheet P109/PS_EN
BG95_1.IO4: sheet P109/USB_BOOT
BG95_1.IO5: sheet P109/W_DISABLE
BG95_1.IO6: sheet P109/SEL0
BG95_1.IO7: sheet P109/SEL1
BG95_2.IO0: sheet P109/AP_READY
BG95_2.IO1: sheet P109/M_UART.DTR
BG95_2.IO2: sheet P109/M_UART.RI
BG95_2.IO3: sheet P109/M_UART.DCD
BG95_2.IO4: sheet P109/PSM_IND
BG95_2.IO5: sheet P109/NET_STATUS
BG95_2.IO6: sheet P109/STATUS
CC1: sheet TCPC/CC1, sheet P104/CC1
CC2: sheet TCPC/CC2, sheet P104/CC2
FAN_PS_CTRL: sheet P104/FAN_PS_VREF, sheet P16_P25/FAN_PS_CTRL
FRS_TX1: sheet TCPC/FRS_TX1, sheet P104/FRS_TX1
FRS_TX2: sheet TCPC/FRS_TX2, sheet P104/FRS_TX2
GPIO.IO4: sheet BC/~{INT}
GPIO.IO5: sheet BC/~{BC_EN}
GPIO.IO6: sheet U_TPS22810 2/EN
GPIO.IO7: sheet AUDIO/A_PA_EN
GPIO_1.IO0: sheet AUDIO/~{RST}
GPIO_1.IO1: sheet AUDIO/~{IRQ}
LCD_BL_A: sheet UI/LED_A, sheet DISP_PS/LED_A
LCD_BL_K: sheet UI/LED_K, sheet DISP_PS/LED_K
LCD_BL_PWM: sheet P104/LCD_BL_PWM, sheet DISP_PS/DIM_CTRL
MOTOR.IO0: sheet P16_P25/FAN_PS_EN
MOTOR.IO1: sheet P16_P25/BLDC_DIR
MOTOR.IO2: sheet P16_P25/STP_STBY/~{RST}
MOTOR.IO3: sheet P16_P25/STP_DRV_EN
MOTOR.IO4: sheet P16_P25/STP_DRV_MOD1
MOTOR.IO5: sheet P16_P25/STP_DRV_MOD2
MOTOR.IO6: sheet P16_P25/STP_DIR_MOD4
MOTOR.IO7: sheet P16_P25/STP_DRV_FLT
SENS.IO3: sheet SENS/~{IMU_INT}  [project net ~{IMU_INT}]
SPEED_CTRL: sheet P104/SPEED_CTRL, sheet P16_P25/SPEED_CTRL  [project net PA1]
SPEED_SENSE: sheet P104/SPEED_SENSE, sheet P16_P25/SPEED_SENSE  [project net PA0]
STP_CLK: sheet P104/STP_CLK, sheet P16_P25/STP_CLK_MOD3  [project net PB9]
STP_VREF_PWM: sheet P104/STP_VREF_PWM, sheet P16_P25/STP_DRV_VREF  [project net PD13]
TCPC.IO0: sheet TCPC/SEL0
TCPC.IO1: sheet TCPC/SEL1
TCPC.IO2: sheet TCPC/~{SBU_SW_EN}
TCPC.IO3: sheet TCPC/~{TCPP_FLT}
VBAT: sheet TP/VBAT, sheet P104/VBAT_SENSE, sheet BC/VBAT
NetR1_1: R1.1 ; sheet +3V3_PS/EN
NetR2_1: R2.1 ; sheet +1V8_PS/EN

### Buses and harness runs
harness BG95_1 = sheet P104/BG95_1
harness BG95_2 = sheet P104/BG95_2
harness DEBUG = sheet P104/UART1
harness DEBUG = sheet TCPC/DEBUG
harness DISP = sheet P104/DISP
harness DISP = sheet UI/DISP
harness DRV10975_TP = sheet P16_P25/TP
harness DRV10975_TP = sheet TP/TP
harness GPIO = sheet P104/GPIO
harness GPIO_1 = sheet P104/GPIO1
harness I2C_C202 = sheet AUDIO/I2C
harness I2C_C202 = sheet BC/I2C
harness I2C_C202 = sheet P16_P25/I2C
harness I2C_C202 = sheet P104/I2C3
harness I2C_C202 = sheet SENS/I2C_C202
harness I2C_C202 = sheet TCPC/I2C
harness I2C_C202 = sheet TP/I2C1
harness I2C_S201 = sheet P104/I2C1
harness I2C_S201 = sheet SENS/I2C_S201
harness I2C_S201 = sheet TP/I2C2
harness I2C_S202 = sheet P104/I2C4
harness I2C_S202 = sheet SENS/I2C_S202
harness I2C_S202 = sheet TP/I2C3
harness I2S = sheet AUDIO/I2S
harness I2S = sheet P104/I2S
harness MICRO_SD = sheet P102/MICRO_SD
harness MICRO_SD = sheet P104/MICRO_SD
harness MOTOR = sheet P104/MOTOR
harness QSPI = sheet FLASH/QSPI
harness QSPI = sheet P104/QSPI
harness SENS = sheet P104/SENS
harness TCPC = sheet P104/TCPC
harness UART_BG95 = sheet P104/UART3
harness UART_BG95 = sheet P109/UART_MUX
harness UART_ESP32 = sheet P104/UART2
harness UART_ESP32 = sheet P107/UART1
harness UI = sheet P104/UI
harness UI = sheet UI/UI
harness USB_BC = sheet BC/USB
harness USB_BC = sheet TCPC/USB_BC
harness USB_BG95 = sheet P109/USB
harness USB_BG95 = sheet TCPC/USB2
harness USB_ESP32 = sheet P107/USB
harness USB_ESP32 = sheet TCPC/USB3
harness USB_STM32 = sheet P104/USB
harness USB_STM32 = sheet TCPC/USB1

### Notes on the sheet
- Title
- Size:
- Date:
- A3
- Number:
- Time:
- Revision:
- Sheet
- of
- File:

### Library data of the parts
R1 R2 = RES SMD 0 OHM JUMPER 1/16W 0402: 0 Ohms Jumper 0.063W, 1/16W Chip Resistor 0402 (1005 Metric) Moisture Resistant Thick Film; Manufacturer: Yageo; Manufacturer Part Number: RC0402JR-070RL; Power Rating: 62.5mW; Voltage Rating: 50V; Max Power Dissipation: 63mW; Temperature Coefficient: 200ppm/°C; Supplier 1: Digi-Key; Stock 1: 46057148; Pricing 1: 1=0.1, 10=0.013, 25=0.0092, 50=0.0072, 100=0.0053, 250=0.004, 500=0.0032, 1000=0.0024, 5000=0.0017 (USD); Contact Plating: Tin,Matte; Case Code (Metric): 1005; Case Code (Imperial): 0402; Min Operating Temperature: -55°C; Max Operating Temperature: 155°C; Packaging: Tape and Reel; Composition: Thick Film; Package Quantity: 1; Number of Terminations: 2; Termination: SMD/SMT; Military Standard: Not; Features: Moisture Resistant; Length: 1mm; Height: 0.016inch; Width: 0.02inch; Depth: 0.5mm; Radiation Hardening: No; REACH SVHC: Unknown; Lead Free: Lead Free; ComponentLink1URL: http://www.yageo.com/documents/recent/PYu-RC_Group_51_RoHS_L_10.pdf?src-supplier=Digi-Key; ComponentLink1Description: http://www.yageo.com/documents/recent/PYu-RC_Group_51_RoHS_L_10.pdf?src-supplier=Digi-Key; ComponentLink2URL: http://www.yageo.com/documents/recent/PYu-RC0402_51_RoHS_L_6.pdf?src-supplier=Avnet+Europe; ComponentLink2Description: http://www.yageo.com/documents/recent/PYu-RC0402_51_RoHS_L_6.pdf?src-supplier=Avnet+Europe; ComponentLink3URL: http://www.farnell.com/datasheets/1018594.pdf?src-supplier=Element14; ComponentLink3Description: http://www.farnell.com/datasheets/1018594.pdf?src-supplier=Element14; ComponentLink4URL: https://www.verical.com/server-webapp/html/getDatasheet?partID=326379&src-supplier=Verical; ComponentLink4Description: https://www.verical.com/server-webapp/html/getDatasheet?partID=326379&src-supplier=Verical; ComponentLink5URL: http://www.farnell.com/datasheets/2167052.pdf?src-supplier=Element14; ComponentLink5Description: http://www.farnell.com/datasheets/2167052.pdf?src-supplier=Element14; Supplier Part Number 1: 311-0.0JRCT-ND; Case/Package: 0402; Mount: Surface Mount
  R1: ClassName: +3V3_PS
  R2: ClassName: +1V8_PS

## Sheet MCU_Module.SchDoc: MCU Module
size A3; DocumentNumber: 4; SheetNumber: 4; SheetTotal: 51
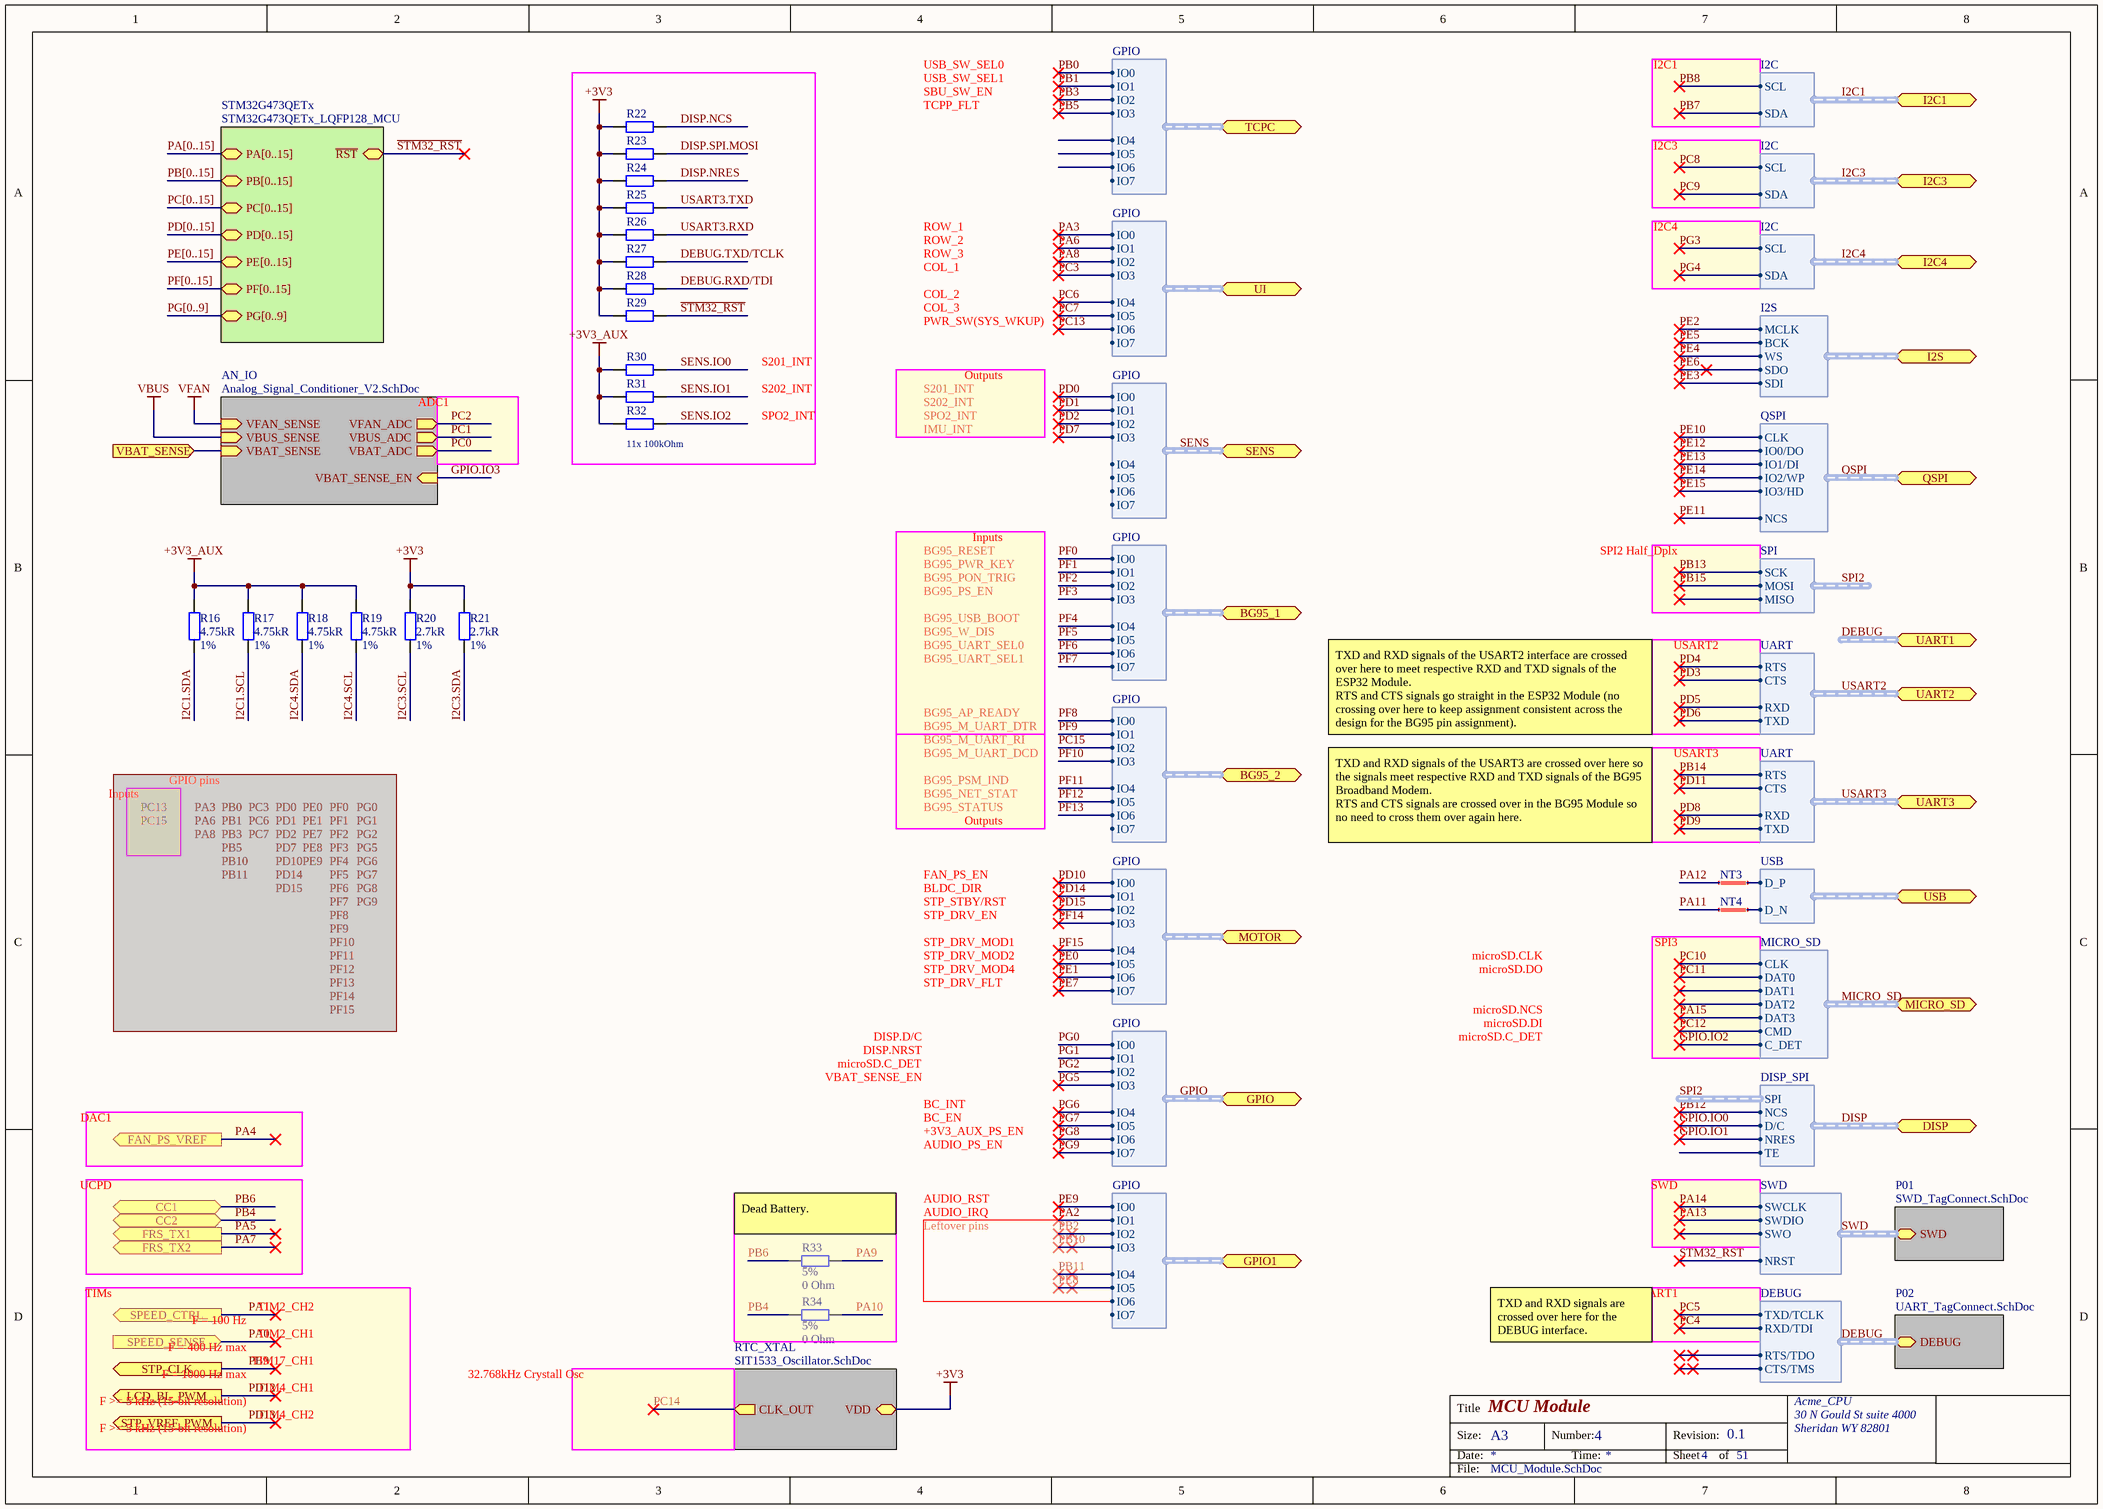
[diagram p3: MCU_Module.SchDoc]

### Parts
NT3  Net Tie  [Net Tie 6x30mil]  (value not drawn)  (net tie, no BOM)
NT4  Net Tie  [Net Tie 6x30mil]  (value not drawn)  (net tie, no BOM)
R16  Resistance: 4.75kR  Tolerance: 1%  [R0402]  (hidden comment: RES SMD 4.75K OHM 1% 1/16W 0402)
R17  Resistance: 4.75kR  Tolerance: 1%  [R0402]  (hidden comment: RES SMD 4.75K OHM 1% 1/16W 0402)
R18  Resistance: 4.75kR  Tolerance: 1%  [R0402]  (hidden comment: RES SMD 4.75K OHM 1% 1/16W 0402)
R19  Resistance: 4.75kR  Tolerance: 1%  [R0402]  (hidden comment: RES SMD 4.75K OHM 1% 1/16W 0402)
R20  Resistance: 2.7kR  Tolerance: 1%  [R0402]  (hidden comment: RES SMD 2.7K OHM 1% 1/16W 0402)
R21  Resistance: 2.7kR  Tolerance: 1%  [R0402]  (hidden comment: RES SMD 2.7K OHM 1% 1/16W 0402)
R22  RES SMD 100K OHM 1% 1/16W 0402  [R0402]  (value not drawn)
R23  RES SMD 100K OHM 1% 1/16W 0402  [R0402]  (value not drawn)
R24  RES SMD 100K OHM 1% 1/16W 0402  [R0402]  (value not drawn)
R25  RES SMD 100K OHM 1% 1/16W 0402  [R0402]  (value not drawn)
R26  RES SMD 100K OHM 1% 1/16W 0402  [R0402]  (value not drawn)
R27  RES SMD 100K OHM 1% 1/16W 0402  [R0402]  (value not drawn)
R28  RES SMD 100K OHM 1% 1/16W 0402  [R0402]  (value not drawn)
R29  RES SMD 100K OHM 1% 1/16W 0402  [R0402]  (value not drawn)
R30  RES SMD 100K OHM 1% 1/16W 0402  [R0402]  (value not drawn)
R31  RES SMD 100K OHM 1% 1/16W 0402  [R0402]  (value not drawn)
R32  RES SMD 100K OHM 1% 1/16W 0402  [R0402]  (value not drawn)
R33  Tolerance: 5%  Resistance: 0 Ohm  [R0402]  (hidden comment: RES SMD 0 OHM JUMPER 1/16W 0402)
R34  Tolerance: 5%  Resistance: 0 Ohm  [R0402]  (hidden comment: RES SMD 0 OHM JUMPER 1/16W 0402)

### Sub-sheets
AN_IO = Analog_Signal_Conditioner_V2.SchDoc (file not in this document): VFAN_SENSE (in), VBUS_SENSE (in), VBAT_SENSE (in), VBAT_ADC (out), VFAN_ADC (out), VBUS_ADC (out), VBAT_SENSE_EN (in)
P01 = SWD_TagConnect.SchDoc (file not in this document): SWD (harness SWD)  | Caption: SWD
P02 = UART_TagConnect.SchDoc: DEBUG (harness DEBUG)  | Caption: DEBUG
RTC_XTAL = SIT1533_Oscillator.SchDoc (file not in this document): CLK_OUT (out), VDD
STM32G473QETx = STM32G473QETx_LQFP128_MCU (file not in this document): ~{RST} (bidir), PA[0..15] (bidir), PB[0..15] (bidir), PC[0..15] (bidir), PF[0..15] (bidir), PD[0..15] (bidir), PE[0..15] (bidir), PG[0..9] (bidir)

### Ports
BG95_1 (harness GPIO), BG95_2 (harness GPIO), CC1 (bidir), CC2 (bidir), DISP (harness DISP_SPI), FAN_PS_VREF (out), FRS_TX1 (out), FRS_TX2 (out), GPIO1 (harness GPIO), GPIO (harness GPIO), I2C1 (harness I2C), I2C3 (harness I2C), I2C4 (harness I2C), I2S (harness I2S), LCD_BL_PWM (out), MICRO_SD (harness MICRO_SD), MOTOR (harness GPIO), QSPI (harness QSPI), SENS (harness GPIO), SPEED_CTRL (out), SPEED_SENSE (in), STP_CLK (out), STP_VREF_PWM (out), TCPC (harness GPIO), UART1 (harness DEBUG), UART2 (harness UART), UART3 (harness UART), UI (harness GPIO), USB (harness USB), VBAT_SENSE (in)

### Harnesses
SWD: SWDIO, SWCLK, NRST, SWO
DEBUG: TXD/TCLK, RXD/TDI, RTS/TDO, CTS/TMS
DISP_SPI: SPI, NCS, D/C, NRES, TE
MICRO_SD: DAT0, DAT1, DAT2, DAT3, CMD, CLK, C_DET
USB: D_P, D_N
SPI: SCK, MISO, MOSI
QSPI: IO0/DO, IO1/DI, NCS, CLK, IO2/WP, IO3/HD
UART: RTS, CTS, RXD, TXD
I2S: WS, SDI, BCK, SDO, MCLK
I2C: SCL, SDA
GPIO: IO0, IO1, IO2, IO3, IO4, IO5, IO6, IO7

### Nets
+3V3: R20.2 R21.2 R22.1 R23.1 R24.1 R25.1 R26.1 R27.1 R28.1 R29.1 ; sheet RTC_XTAL/VDD
+3V3_AUX: R16.2 R17.2 R18.2 R19.2 R30.1 R31.1 R32.1
VBUS: sheet AN_IO/VBUS_SENSE
~{STM32_RST}: R29.2 ; sheet STM32G473QETx/~{RST}, sheet P01/SWD.NRST
DEBUG.RXD/TDI: R28.2
DEBUG.TXD/TCLK: R27.2
DISP.NCS: R22.2
DISP.NRES: R24.2
DISP.SPI.MOSI: R23.2
GPIO.IO0: port DISP.D/C  [project net DISP.D/C]
GPIO.IO1: port DISP.NRES  [project net DISP.NRES]
GPIO.IO2: port MICRO_SD.C_DET
GPIO.IO3: sheet AN_IO/VBAT_SENSE_EN
I2C1.SCL: R17.1
I2C1.SDA: R16.1
I2C3.SCL: R20.1
I2C3.SDA: R21.1
I2C4.SCL: R19.1
I2C4.SDA: R18.1
PA2: port GPIO1.IO1  [project net GPIO_1.IO1]
PA3: port UI.IO0
PA4: port FAN_PS_VREF  [project net FAN_PS_CTRL]
PA5: port FRS_TX1  [project net FRS_TX1]
PA6: port UI.IO1
PA7: port FRS_TX2  [project net FRS_TX2]
PA8: port UI.IO2
PA9: R33.2
PA10: R34.2
PA11: NT4.1
PA12: NT3.1
PA13: sheet P01/SWD.SWDIO
PA14: sheet P01/SWD.SWCLK
PA15: port MICRO_SD.DAT3  [project net MICRO_SD.DAT3]
PB0: port TCPC.IO0
PB1: port TCPC.IO1
PB2: port GPIO1.IO2  [project net GPIO_1.IO2]
PB3: port TCPC.IO2
PB4: R34.1 ; port CC2  [project net CC2]
PB5: port TCPC.IO3
PB6: R33.1 ; port CC1  [project net CC1]
PB7: port I2C1.SDA  [project net I2C1.SDA]
PB8: port I2C1.SCL  [project net I2C1.SCL]
PB9: port STP_CLK
PB10: port GPIO1.IO3  [project net GPIO_1.IO3]
PB11: port GPIO1.IO4  [project net GPIO_1.IO4]
PB12: port DISP.NCS  [project net DISP.NCS]
PB13: harness SPI.SCK
PB14: port UART3.RTS
PB15: harness SPI.MOSI
PC0: sheet AN_IO/VBAT_ADC
PC1: sheet AN_IO/VBUS_ADC
PC2: sheet AN_IO/VFAN_ADC
PC3: port UI.IO3
PC4: port UART1.RXD/TDI  [project net DEBUG.RXD/TDI]
PC5: port UART1.TXD/TCLK  [project net DEBUG.TXD/TCLK]
PC6: port UI.IO4
PC7: port UI.IO5
PC8: port I2C3.SCL  [project net I2C.SCL]
PC9: port I2C3.SDA  [project net I2C.SDA]
PC10: port MICRO_SD.CLK  [project net MICRO_SD.CLK]
PC11: port MICRO_SD.DAT0  [project net MICRO_SD.DAT0]
PC12: port MICRO_SD.CMD  [project net MICRO_SD.CMD]
PC13: port UI.IO6
PC14: sheet RTC_XTAL/CLK_OUT
PC15: port BG95_2.IO2  [project net BG95_2.IO2]
PD0: port SENS.IO0
PD1: port SENS.IO1
PD2: port SENS.IO2
PD3: port UART2.CTS  [project net GPIO1]
PD4: port UART2.RTS  [project net GPIO0]
PD5: port UART2.RXD  [project net GPIO2]
PD6: port UART2.TXD  [project net GPIO3]
PD7: port SENS.IO3
PD8: port UART3.RXD
PD9: port UART3.TXD
PD10: port MOTOR.IO0  [project net MOTOR.IO0]
PD11: port UART3.CTS
PD12: port LCD_BL_PWM  [project net LCD_BL_PWM]
PD13: port STP_VREF_PWM
PD14: port MOTOR.IO1  [project net MOTOR.IO1]
PD15: port MOTOR.IO2  [project net MOTOR.IO2]
PE0: port MOTOR.IO5  [project net MOTOR.IO5]
PE1: port MOTOR.IO6  [project net MOTOR.IO6]
PE2: port I2S.MCLK  [project net I2S.MCLK]
PE3: port I2S.SDI  [project net I2S.SDI]
PE4: port I2S.WS  [project net I2S.WS]
PE5: port I2S.BCK  [project net I2S.BCK]
PE6: port I2S.SDO  [project net I2S.SDO]
PE7: port MOTOR.IO7  [project net MOTOR.IO7]
PE8: port GPIO1.IO5  [project net GPIO_1.IO5]
PE9: port GPIO1.IO0  [project net GPIO_1.IO0]
PE10: port QSPI.CLK
PE11: port QSPI.NCS
PE12: port QSPI.IO0/DO
PE13: port QSPI.IO1/DI
PE14: port QSPI.IO2/WP
PE15: port QSPI.IO3/HD
PF0: port BG95_1.IO0  [project net BG95_1.IO0]
PF1: port BG95_1.IO1  [project net BG95_1.IO1]
PF2: port BG95_1.IO2  [project net BG95_1.IO2]
PF3: port BG95_1.IO3  [project net BG95_1.IO3]
PF4: port BG95_1.IO4  [project net BG95_1.IO4]
PF5: port BG95_1.IO5  [project net BG95_1.IO5]
PF6: port BG95_1.IO6  [project net BG95_1.IO6]
PF7: port BG95_1.IO7  [project net BG95_1.IO7]
PF8: port BG95_2.IO0  [project net BG95_2.IO0]
PF9: port BG95_2.IO1  [project net BG95_2.IO1]
PF10: port BG95_2.IO3  [project net BG95_2.IO3]
PF11: port BG95_2.IO4  [project net BG95_2.IO4]
PF12: port BG95_2.IO5  [project net BG95_2.IO5]
PF13: port BG95_2.IO6  [project net BG95_2.IO6]
PF14: port MOTOR.IO3  [project net MOTOR.IO3]
PF15: port MOTOR.IO4  [project net MOTOR.IO4]
PG0: port GPIO.IO0  [project net GPIO.IO0]
PG1: port GPIO.IO1  [project net GPIO.IO1]
PG2: port GPIO.IO2  [project net GPIO.IO2]
PG3: port I2C4.SCL  [project net I2C4.SCL]
PG4: port I2C4.SDA  [project net I2C4.SDA]
PG5: port GPIO.IO3  [project net GPIO.IO3]
PG6: port GPIO.IO4  [project net GPIO.IO4]
PG7: port GPIO.IO5  [project net GPIO.IO5]
PG8: port GPIO.IO6  [project net GPIO.IO6]
PG9: port GPIO.IO7  [project net GPIO.IO7]
SENS.IO0: R30.2
SENS.IO1: R31.2
SENS.IO2: R32.2
USART3.RXD: R26.2
USART3.TXD: R25.2
USB_STM32.D_N: NT4.2 ; port USB.D_N
USB_STM32.D_P: NT3.2 ; port USB.D_P
VBAT: port VBAT_SENSE, sheet AN_IO/VBAT_SENSE

### Buses and harness runs
bus PA[0..15] = sheet STM32G473QETx/PA[0..15]
bus PB[0..15] = sheet STM32G473QETx/PB[0..15]
bus PC[0..15] = sheet STM32G473QETx/PC[0..15]
bus PD[0..15] = sheet STM32G473QETx/PD[0..15]
bus PE[0..15] = sheet STM32G473QETx/PE[0..15]
bus PF[0..15] = sheet STM32G473QETx/PF[0..15]
bus PG[0..9] = sheet STM32G473QETx/PG[0..9]
harness DEBUG = port UART1
harness DEBUG = sheet P02/DEBUG
harness DISP = port DISP
harness GPIO = port GPIO
harness I2C1 = port I2C1
harness I2C3 = port I2C3
harness I2C4 = port I2C4
harness MICRO_SD = port MICRO_SD
harness QSPI = port QSPI
harness SENS = port SENS
harness SWD = sheet P01/SWD
harness USART2 = port UART2
harness USART3 = port UART3

### Notes on the sheet
- TCPP_FLT
- USB_SW_SEL0
- USB_SW_SEL1
- SBU_SW_EN
- I2C1
- I2C3
- ROW_1
- ROW_2
- I2C4
- ROW_3
- COL_1
- COL_2
- COL_3
- S201_INT
- PWR_SW(SYS_WKUP)
- Outputs
- ADC1
- (near R32) 11x 100kOhm
- S202_INT
- SPO2_INT
- IMU_INT
- BG95_RESET
- BG95_PWR_KEY
- BG95_PON_TRIG
- Inputs
- SPI2 Half_Dplx
- BG95_PS_EN
- BG95_USB_BOOT
- BG95_W_DIS
- BG95_UART_SEL0
- USART2
- BG95_AP_READY
- BG95_UART_SEL1
- GPIO pins
- BG95_PSM_IND
- BG95_M_UART_RI
- BG95_M_UART_DCD
- BG95_M_UART_DTR
- TXD and RXD signals of the USART2 interface are crossed over here to meet respective RXD and TXD signals of the ESP32 Module.
  RTS and CTS signals go straight in the ESP32 Module (no crossing over here to keep assignment consistent across the design for the BG95 pin assignment).
- USART3
- BG95_NET_STAT
- BG95_STATUS
- TXD and RXD signals of the USART3 are crossed over here so the signals meet respective RXD and TXD signals of the BG95 Broadband Modem.
  RTS and CTS signals are crossed over in the BG95 Module so no need to cross them over again here.
- FAN_PS_EN
- BLDC_DIR
- STP_STBY/RST
- STP_DRV_EN
- STP_DRV_MOD1
- STP_DRV_MOD2
- STP_DRV_MOD4
- STP_DRV_FLT
- microSD.CLK
- microSD.DO
- (near NT4) SPI3
- DISP.D/C
- DISP.NRST
- microSD.NCS
- microSD.DI
- microSD.C_DET
- DAC1
- VBAT_SENSE_EN
- BC_INT
- BC_EN
- UCPD
- +3V3_AUX_PS_EN
- AUDIO_PS_EN
- SWD
- (near R33) Dead Battery.
- AUDIO_RST
- AUDIO_IRQ
- Leftover pins
- TIMs
- F = 100 Hz
- TIM2_CH2
- USART1
- F = 400 Hz max
- F = 1000 Hz max
- TIM17_CH1
- TIM4_CH1
- TIM2_CH1
- 32.768kHz Crystall Osc
- TXD and RXD signals are crossed over here for the DEBUG interface.
- F >= 5 kHz (15-bit resolution)
- TIM4_CH2
- Title
- Size:
- Date:
- A3
- Number:
- Time:
- Revision:
- Sheet
- of
- File:

### Library data of the parts
NT3 NT4 = Net Tie Line: ClassName: STM32G473CETx
R16-R19 = RES SMD 4.75K OHM 1% 1/16W 0402: 4.75 kOhms ±1% 0.063W, 1/16W Chip Resistor 0402 (1005 Metric) Moisture Resistant Thick Film; Manufacturer: Yageo; Manufacturer Part Number: RC0402FR-074K75P; Max Power Dissipation: 63mW; Temperature Coefficient: 150ppm/°C; Case/Package: 0402; Supplier 1: Digi-Key; Stock 1: 23485; Pricing 1: 1=0.1, 10=0.035, 100=0.014, 1000=0.0063, 2500=0.0055, 5000=0.0045 (USD); Case Code (Metric): 1005; Case Code (Imperial): 0402; Min Operating Temperature: -55°C; Max Operating Temperature: 155°C; Packaging: Tape and Reel; Composition: Thick Film; Number of Terminations: 2; Features: Moisture Resistant; Length: 0.039inch; Height: 0.016inch; Width: 0.02inch; ComponentLink1URL: http://www.yageo.com/NewPortal/yageodocoutput?fileName=/pdf/R-Chip/PYu-RC_51_RoHS_P_0.pdf&src-supplier=Digi-Key; ComponentLink1Description: http://www.yageo.com/NewPortal/yageodocoutput?fileName=/pdf/R-Chip/PYu-RC_51_RoHS_P_0.pdf&src-supplier=Digi-Key; ComponentLink2URL: http://www.yageo.com.tw/exep/pages/download/literatures/PYu-R_INT-thick_7.pdf?src-supplier=Digi-Key; ComponentLink2Description: http://www.yageo.com.tw/exep/pages/download/literatures/PYu-R_INT-thick_7.pdf?src-supplier=Digi-Key; Supplier Part Number 1: YAG1271CT-ND; ClassName: I2C_SW; Mount: Surface Mount
R20 R21 = RES SMD 2.7K OHM 1% 1/16W 0402: 2.7 kOhms ±1% 0.063W, 1/16W Chip Resistor 0402 (1005 Metric) Moisture Resistant Thick Film; Manufacturer: Yageo; Manufacturer Part Number: RC0402FR-072K7L; Power Rating: 63mW; Temperature Coefficient: 100ppm/°C; Voltage Rating: 50V; Supplier 1: Digi-Key; Stock 1: 261850; Pricing 1: 1=0.1, 10=0.016, 100=0.0064, 1000=0.0029, 2500=0.0025, 5000=0.0021 (USD); Case/Package: 0402; Case Code (Imperial): 0402; Case Code (Metric): 1005; Min Operating Temperature: -55°C; Max Operating Temperature: 155°C; Packaging: Tape and Reel; Package Quantity: 1; Termination: SMD/SMT; Composition: Thick Film; Number of Terminations: 2; Military Standard: Not; Max Power Dissipation: 63mW; Features: Moisture Resistant; Working Voltage: 50V; Length: 1mm; Height: 0.016inch; Width: 0.02inch; Depth: 0.5mm; REACH SVHC: Unknown; Lead Free: Lead Free; ComponentLink1URL: http://www.mouser.com/ds/2/447/PYu-RC0402_51_RoHS_L_6_r-8721.pdf?src-supplier=Mouser; ComponentLink1Description: http://www.mouser.com/ds/2/447/PYu-RC0402_51_RoHS_L_6_r-8721.pdf?src-supplier=Mouser; ComponentLink2URL: http://www.yageo.com/documents/recent/PYu-RC_Group_51_RoHS_L_9.pdf?src-supplier=Digi-Key; ComponentLink2Description: http://www.yageo.com/documents/recent/PYu-RC_Group_51_RoHS_L_9.pdf?src-supplier=Digi-Key; ComponentLink3URL: http://www.yageo.com/documents/recent/PYu-RC_Group_51_RoHS_L_10.pdf?src-supplier=Digi-Key; ComponentLink3Description: http://www.yageo.com/documents/recent/PYu-RC_Group_51_RoHS_L_10.pdf?src-supplier=Digi-Key; ComponentLink4URL: http://www.farnell.com/datasheets/2167052.pdf?src-supplier=Element14; ComponentLink4Description: http://www.farnell.com/datasheets/2167052.pdf?src-supplier=Element14; Supplier Part Number 1: 311-2.70KLRCT-ND; ClassName: STM32G473CETx; Mount: Surface Mount
R22-R32 = RES SMD 100K OHM 1% 1/16W 0402: 100 kOhms ±1% 0.063W, 1/16W Chip Resistor 0402 (1005 Metric) Moisture Resistant Thick Film; Manufacturer: Yageo; Manufacturer Part Number: RC0402FR-07100KL; Temperature Coefficient: 100ppm/°C; Power Rating: 63mW; Voltage Rating: 50V; Supplier 1: Digi-Key; Stock 1: 47448883; Pricing 1: 1=0.1, 10=0.016, 100=0.0064, 1000=0.0029, 2500=0.0025, 5000=0.0021 (USD); Case Code (Metric): 1005; Case Code (Imperial): 0402; Min Operating Temperature: -55°C; Max Operating Temperature: 155°C; Composition: Thick Film; Packaging: Tape and Reel; Termination: SMD/SMT; Military Standard: Not; Length: 0.039inch; Height: 0.016inch; Width: 0.02inch; Depth: 0.5mm; Lead Free: Lead Free; ComponentLink1URL: http://www.yageo.com/documents/recent/PYu-RC_Group_51_RoHS_L_10.pdf?src-supplier=Digi-Key; ComponentLink1Description: http://www.yageo.com/documents/recent/PYu-RC_Group_51_RoHS_L_10.pdf?src-supplier=Digi-Key; ComponentLink2URL: http://www.farnell.com/datasheets/1018594.pdf?src-supplier=Element14; ComponentLink2Description: http://www.farnell.com/datasheets/1018594.pdf?src-supplier=Element14; ComponentLink3URL: http://www.yageo.com/documents/recent/PYu-RC_Group_51_RoHS_L_9.pdf?src-supplier=Verical; ComponentLink3Description: http://www.yageo.com/documents/recent/PYu-RC_Group_51_RoHS_L_9.pdf?src-supplier=Verical; Supplier Part Number 1: 311-100KLRDKR-ND; Case/Package: 0402; Tolerance: 1%; Resistance: 100 kOhm; Package Quantity: 1; Number of Terminations: 2; Max Power Dissipation: 63mW; Working Voltage: 50V; Features: Moisture Resistant; REACH SVHC: No SVHC; ComponentLink4URL: http://www.yageo.com/documents/recent/PYu-RC_Group_51_RoHS_L_9.pdf?src-supplier=Mouser; ComponentLink4Description: http://www.yageo.com/documents/recent/PYu-RC_Group_51_RoHS_L_9.pdf?src-supplier=Mouser; ComponentLink5URL: http://documents.rs-components.com/techlib://itc_doclist_GB.htm?stockno=6185797&src-supplier=RSComponents; ComponentLink5Description: http://documents.rs-components.com/techlib://itc_doclist_GB.htm?stockno=6185797&src-supplier=RSComponents; Mount: Surface Mount
R33 R34 = RES SMD 0 OHM JUMPER 1/16W 0402: as R1 on sheet Top_Level_Block_Diagram; Case/Package: 0402; Supplier 1: Digi-Key; Stock 1: 46057148; Pricing 1: 1=0.1, 10=0.013, 25=0.0092, 50=0.0072, 100=0.0053, 250=0.004, 500=0.0032, 1000=0.0024, 5000=0.0017 (USD); Contact Plating: Tin,Matte; Case Code (Metric): 1005; Case Code (Imperial): 0402; Min Operating Temperature: -55°C; Max Operating Temperature: 155°C; Packaging: Tape and Reel; Composition: Thick Film; Package Quantity: 1; Number of Terminations: 2; Termination: SMD/SMT; Military Standard: Not; Features: Moisture Resistant; Length: 1mm; Height: 0.016inch; Width: 0.02inch; Depth: 0.5mm; Radiation Hardening: No; REACH SVHC: Unknown; Lead Free: Lead Free; ComponentLink1URL: http://www.yageo.com/documents/recent/PYu-RC_Group_51_RoHS_L_10.pdf?src-supplier=Digi-Key; ComponentLink1Description: http://www.yageo.com/documents/recent/PYu-RC_Group_51_RoHS_L_10.pdf?src-supplier=Digi-Key; ComponentLink2URL: http://www.yageo.com/documents/recent/PYu-RC0402_51_RoHS_L_6.pdf?src-supplier=Avnet+Europe; ComponentLink2Description: http://www.yageo.com/documents/recent/PYu-RC0402_51_RoHS_L_6.pdf?src-supplier=Avnet+Europe; ComponentLink3URL: http://www.farnell.com/datasheets/1018594.pdf?src-supplier=Element14; ComponentLink3Description: http://www.farnell.com/datasheets/1018594.pdf?src-supplier=Element14; ComponentLink4URL: https://www.verical.com/server-webapp/html/getDatasheet?partID=326379&src-supplier=Verical; ComponentLink4Description: https://www.verical.com/server-webapp/html/getDatasheet?partID=326379&src-supplier=Verical; ComponentLink5URL: http://www.farnell.com/datasheets/2167052.pdf?src-supplier=Element14; ComponentLink5Description: http://www.farnell.com/datasheets/2167052.pdf?src-supplier=Element14; Supplier Part Number 1: 311-0.0JRCT-ND; ClassName: STM32G473CETx; Mount: Surface Mount

## Sheet UART_TagConnect.SchDoc: Tag-Connect DEBUG Port
size A4; DocumentNumber: 8; SheetNumber: 8; SheetTotal: 51
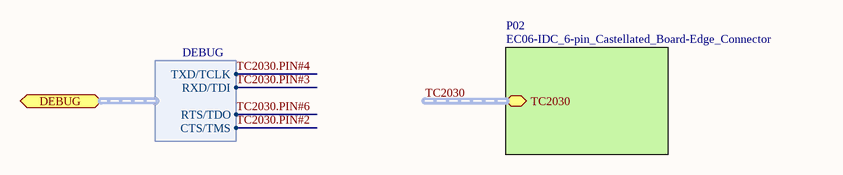
[diagram p4: UART_TagConnect.SchDoc]

### Sub-sheets
P02 = EC06-IDC_6-pin_Castellated_Board-Edge_Connector (file not in this document): TC2030 (harness TC2030)

### Ports
DEBUG (harness DEBUG)

### Harnesses
DEBUG: TXD/TCLK, RXD/TDI, RTS/TDO, CTS/TMS

### Buses and harness runs
harness TC2030 = sheet P02/TC2030

### Notes on the sheet
- Title
- Size:
- Date:
- A4
- Number:
- Time:
- Revision:
- Sheet
- of
- File: